# EAGLE design mroneV0-4 (EAGLE 5.09)
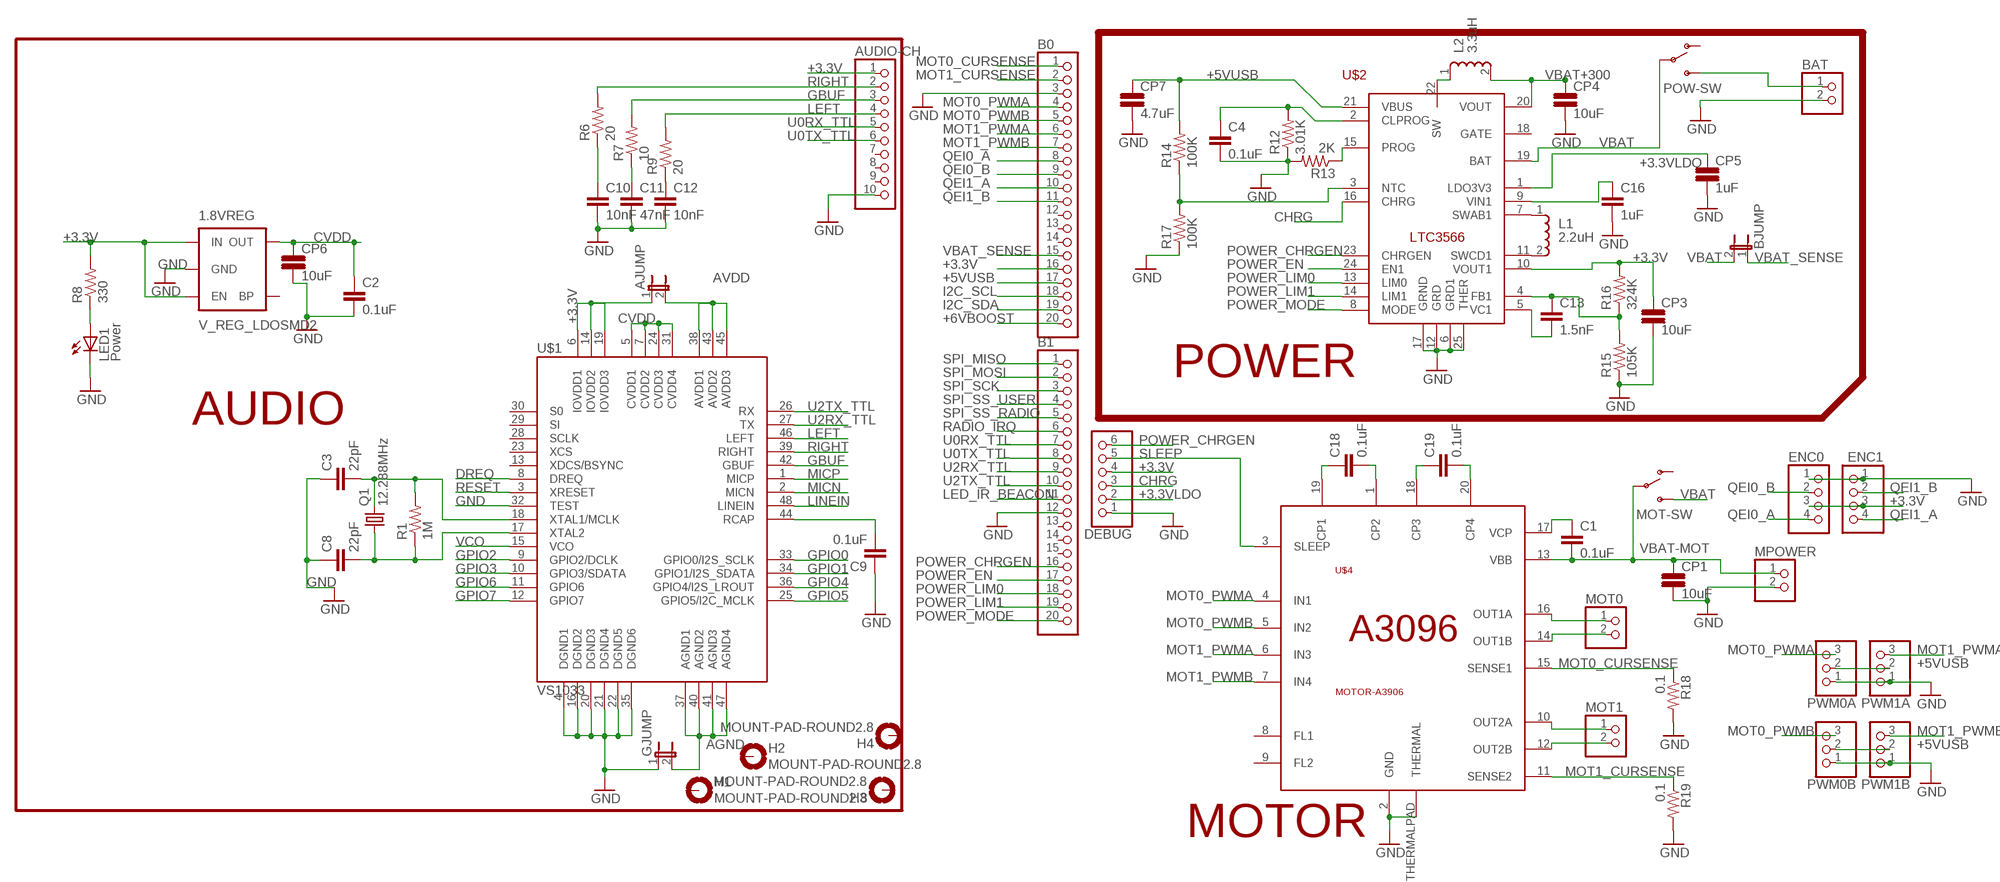
[diagram p0: schematic, sheet 1]

## Parts
1.8VREG  V_REG_LDOSMD2  [SC70]
AJUMP  JUMPER-2PTH  [1X02]
AUDIO-CH  PINHD-1X10  [1X10]
B0  PINHD-1X20  [1X20]
B1  PINHD-1X20  [1X20]
BAT  PINHD-1X2  [1X02]
BJUMP  JUMPER-2PTH  [1X02]
C1  0.1uF  CAP0402-CAP  [0402-CAP]
C2  0.1uF  CAP0402-CAP  [0402-CAP]
C3  22pF  CAP0402-CAP  [0402-CAP]
C4  0.1uF  CAP0402-CAP  [0402-CAP]
C8  22pF  CAP0402-CAP  [0402-CAP]
C9  0.1uF  CAP0402-CAP  [0402-CAP]
C10  10nF  CAP0402-CAP  [0402-CAP]
C11  47nF  CAP0402-CAP  [0402-CAP]
C12  10nF  CAP0402-CAP  [0402-CAP]
C13  1.5nF  CAP0402-CAP  [0402-CAP]
C16  1uF  CAP0402-CAP  [0402-CAP]
C18  0.1uF  CAP0402-CAP  [0402-CAP]
C19  0.1uF  CAP0402-CAP  [0402-CAP]
CP1  10uF  CAP-L  [0603-CAP]
CP3  10uF  CAP-L  [0603-CAP]
CP4  10uF  CAP-L  [0603-CAP]
CP5  1uF  CAP-L  [0603-CAP]
CP6  10uF  CAP-L  [0603-CAP]
CP7  4.7uF  CAP-L  [0603-CAP]
DEBUG  PINHD-1X6  [1X06]
ENC0  PINHD-1X4  [1X04]
ENC1  PINHD-1X4  [1X04]
GJUMP  JUMPER-2PTH  [1X02]
H1  MOUNT-PAD-ROUND2.8  [2,8-PAD]
H2  MOUNT-PAD-ROUND2.8  [2,8-PAD]
H3  MOUNT-PAD-ROUND2.8  [2,8-PAD]
H4  MOUNT-PAD-ROUND2.8  [2,8-PAD]
L1  2.2uH  INDUC-LPS4018LPS4018-REC  [LPS4018-REC]
L2  3.3uH  INDUC-LPS4018LPS4018-REC  [LPS4018-REC]
LED1  Power  LED0603  [LED-0603]
MOT0  PINHD-1X2  [1X02]
MOT1  PINHD-1X2/90  [1X02/90]
MOT-SW  SWITCH-SPSTPTH  [SWITCH-SPDT]
MPOWER  PINHD-1X2  [1X02]
POW-SW  SWITCH-SPSTPTH  [SWITCH-SPDT]
PWM0A  PINHD-1X3  [1X03]
PWM0B  PINHD-1X3  [1X03]
PWM1A  PINHD-1X3  [1X03]
PWM1B  PINHD-1X3  [1X03]
Q1  12.288MHz  CRYSTAL5X3  [CRYSTAL-SMD-5X3]
R1  1M  RESISTOR0603-RES  [0603-RES]
R6  20  RESISTOR0603-RES  [0603-RES]
R7  10  RESISTOR0603-RES  [0603-RES]
R8  330  RESISTOR0603-RES  [0603-RES]
R9  20  RESISTOR0603-RES  [0603-RES]
R12  3.01K  RESISTOR0603-RES  [0603-RES]
R13  2K  RESISTOR0603-RES  [0603-RES]
R14  100K  RESISTOR0603-RES  [0603-RES]
R15  105K  RESISTOR0603-RES  [0603-RES]
R16  324K  RESISTOR0603-RES  [0603-RES]
R17  100K  RESISTOR0603-RES  [0603-RES]
R18  0.1  RESISTOR0603-RES  [0603-RES]
R19  0.1  RESISTOR0603-RES  [0603-RES]
U$1  VS1033  [LQFP-48]
U$2  POWER-LTC3566  [QFN-24]
U$4  MOTOR-A3906  [QFN-20]

## Nets
+3.3V [power]: 1.8VREG.1(IN) 1.8VREG.3(EN) AJUMP.1 AUDIO-CH.1 B0.16 CP3.1 DEBUG.4 ENC0.3 ENC1.3 R8.2 R16.2 U$1.6(IOVDD1) U$1.14(IOVDD2) U$1.19(IOVDD3) U$2.10(VOUT1)
+3.3VLDO: CP5.1 DEBUG.2 U$2.1(LDO3V3)
+5VUSB [power]: B0.17 CP7.1 PWM0A.2 PWM0B.2 PWM1A.2 PWM1B.2 R14.2 U$2.21(VBUS)
+6VBOOST: B0.20
AGND: GJUMP.2 U$1.37(AGND1) U$1.40(AGND2) U$1.41(AGND3) U$1.47(AGND4)
AVDD: AJUMP.2 U$1.38(AVDD1) U$1.43(AVDD2) U$1.45(AVDD3)
CHRG: DEBUG.3 U$2.16(CHRG)
CVDD: 1.8VREG.5(OUT) C2.1 CP6.1 U$1.5(CVDD1) U$1.7(CVDD2) U$1.24(CVDD3) U$1.31(CVDD4)
DREQ: U$1.8(DREQ)
GBUF: AUDIO-CH.3 R7.2 U$1.42(GBUF)
GND: 1.8VREG.2(GND) AUDIO-CH.10 B0.3 B1.12 BAT.2 C2.2 C3.1 C4.2 C8.1 C9.1 C10.2 C11.2 C12.2 C16.2 CP1.2 CP3.2 CP4.2 CP5.2 CP6.2 CP7.2 DEBUG.1 ENC0.1 ENC1.1 GJUMP.1 LED1.C MPOWER.2 PWM0A.1 PWM0B.1 PWM1A.1 PWM1B.1 R12.1 R13.2 R15.1 R17.1 R18.2 R19.2 U$1.4(DGND1) U$1.16(DGND2) U$1.20(DGND3) U$1.21(DGND4) U$1.22(DGND5) U$1.32(TEST) U$1.35(DGND6) U$2.6(GRD1) U$2.12(GRD) U$2.17(GRND) U$2.25(THER) U$4.2(GND) U$4.THERMALPAD(THERMAL)
GPIO0: U$1.33(GPIO0/I2S_SCLK)
GPIO1: U$1.34(GPIO1/I2S_SDATA)
GPIO2: U$1.9(GPIO2/DCLK)
GPIO3: U$1.10(GPIO3/SDATA)
GPIO4: U$1.36(GPIO4/I2S_LROUT)
GPIO5: U$1.25(GPIO5/I2C_MCLK)
GPIO6: U$1.11(GPIO6)
GPIO7: U$1.12(GPIO7)
I2C_SCL: B0.18
I2C_SDA: B0.19
LED_IR_BEACON: B1.11
LEFT: AUDIO-CH.4 R9.2 U$1.46(LEFT)
LINEIN: U$1.48(LINEIN)
MICN: U$1.2(MICN)
MICP: U$1.1(MICP)
MOT0_CURSENSE [power]: B0.1 R18.1 U$4.15(SENSE1)
MOT0_PWMA: B0.4 PWM0A.3 U$4.4(IN1)
MOT0_PWMB: B0.5 PWM0B.3 U$4.5(IN2)
MOT1_CURSENSE [power]: B0.2 R19.1 U$4.11(SENSE2)
MOT1_PWMA: B0.6 PWM1A.3 U$4.6(IN3)
MOT1_PWMB: B0.7 PWM1B.3 U$4.7(IN4)
N$1: C9.2 U$1.44(RCAP)
N$2: C12.1 R9.1
N$3: C10.1 R6.1
N$4: C18.1 U$4.19(CP1)
N$5: C11.1 R7.1
N$6: LED1.A R8.1
N$7: R14.1 R17.2 U$2.3(NTC)
N$8: C4.1 R12.2 U$2.2(CLPROG)
N$9: C3.2 Q1.3 R1.2 U$1.18(XTAL1/MCLK)
N$10: C8.2 Q1.1 R1.1 U$1.17(XTAL2)
N$11: L2.1(A) U$2.22(SW)
N$12 [motors]: MOT0.1 U$4.16(OUT1A)
N$13: L1.1(A) U$2.7(SWAB1)
N$14: L1.2(E) U$2.11(SWCD1)
N$15: C13.2 U$2.5(VC1)
N$16: C13.1 R15.2 R16.1 U$2.4(FB1)
N$17: C16.1 U$2.9(VIN1)
N$18 [motors]: MOT0.2 U$4.14(OUT1B)
N$19 [motors]: MOT1.2 U$4.12(OUT2B)
N$20 [motors]: MOT1.1 U$4.10(OUT2A)
N$21 [motors]: BAT.1 POW-SW.3(S)
N$23: C18.2 U$4.1(CP2)
N$24: R13.1 U$2.15(PROG)
N$26: C19.1 U$4.18(CP3)
N$28: C19.2 U$4.20(CP4)
N$29: C1.1 U$4.17(VCP)
POWER_CHRGEN: B1.16 DEBUG.6 U$2.23(CHRGEN)
POWER_EN: B1.17 U$2.24(EN1)
POWER_LIM0: B1.18 U$2.13(LIM0)
POWER_LIM1: B1.19 U$2.14(LIM1)
POWER_MODE: B1.20 U$2.8(MODE)
QEI0_A: B0.8 ENC0.4
QEI0_B: B0.9 ENC0.2
QEI1_A: B0.10 ENC1.4
QEI1_B: B0.11 ENC1.2
RADIO_IRQ: B1.6
RESET: U$1.3(XRESET)
RIGHT: AUDIO-CH.2 R6.2 U$1.39(RIGHT)
SLEEP: DEBUG.5 U$4.3(SLEEP)
SPI_MISO: B1.1
SPI_MOSI: B1.2
SPI_SCK: B1.3
SPI_SS_RADIO: B1.5
SPI_SS_USER: B1.4
U0RX_TTL: AUDIO-CH.5 B1.7
U0TX_TTL: AUDIO-CH.6 B1.8
U2RX_TTL: B1.9 U$1.27(TX)
U2TX_TTL: B1.10 U$1.26(RX)
VBAT [power]: BJUMP.2 MOT-SW.3(S) POW-SW.2(P) U$2.19(BAT)
VBAT+300: CP4.1 L2.2(E) U$2.20(VOUT)
VBAT-MOT: C1.2 CP1.1 MOT-SW.2(P) MPOWER.1 U$4.13(VBB)
VBAT_SENSE [power]: B0.15 BJUMP.1
VCO: U$1.15(VCO)
Unconnected: 1.8VREG.4(BP) AUDIO-CH.7 AUDIO-CH.8 AUDIO-CH.9 B0.12 B0.13 B0.14 B1.13 B1.14 B1.15 H1.B2,8(MOUNT) H2.B2,8(MOUNT) H3.B2,8(MOUNT) H4.B2,8(MOUNT) MOT-SW.1(O) POW-SW.1(O) U$1.13(XDCS/BSYNC) U$1.23(XCS) U$1.28(SCLK) U$1.29(SI) U$1.30(S0) U$2.18(GATE) U$4.8(FL1) U$4.9(FL2)

## Notes on the sheet
- POWER
- AUDIO
- MOTOR

## Library data of the parts
1.8VREG = SparkFun:V_REG_LDO: Voltage Regulator LDO Standard 150mA LDO voltage regulator in SOT-23 layout. Micrel part MIC5205. BP (by-pass) pin is used to lower output noise with 470pF cap.
AJUMP BJUMP GJUMP = SparkFun:JUMPER-2: Jumper Basic 0.1" spaced jumper. Use with breakaway headers.
AUDIO-CH = pinhead:PINHD-1X10: PIN HEADER
B0 B1 = pinhead:PINHD-1X20: PIN HEADER
BAT MOT0 MOT1 MPOWER = pinhead:PINHD-1X2: PIN HEADER
C1-C4 C8-C13 C16 C18 C19 = SparkFun:CAP: Capacitor Standard 0603 ceramic capacitor, and 0.1" leaded capacitor.
CP1 CP3-CP7 = mrone:CAP-L
DEBUG = pinhead:PINHD-1X6: PIN HEADER
ENC0 ENC1 = pinhead:PINHD-1X4: PIN HEADER
H1-H4 = holes:MOUNT-PAD-ROUND: MOUNTING PAD, round
L1 L2 = mrone:INDUC-LPS4018
LED1 = SparkFun:LED: LEDs Standard schematic elements and footprints for 5mm, 3mm, 1206, and 0603 sized LEDs. 5mm - Spark Fun Electronics SKU : COM-00529 (and others)
MOT-SW POW-SW = SparkFun:SWITCH-SPST: SPST Switch Simple slide switch. Spark Fun Electronics SKU : COM-00102
PWM0A PWM0B PWM1A PWM1B = pinhead:PINHD-1X3: PIN HEADER
Q1 = SparkFun:CRYSTAL: Crystals Various standard crystals. Proven footprints. Spark Fun Electronics SKU : COM-00534
R1 R6-R9 R12-R19 = SparkFun:RESISTOR: Resistor Basic schematic elements and footprints for 0603, 1206, and PTH 1/10th watt (small) resistors.
U$1 = SparkFun:VS1033
U$2 = mrone:POWER-LTC3566
U$4 = mrone:MOTOR-A3906

## Net classes
0 default: width 0.203 mm, drill 0.203 mm, clearance 0.203 mm
1 motors: width 0.457 mm, drill 0.203 mm, clearance 0.203 mm
2 power: width 0.279 mm, drill 0.203 mm, clearance 0.203 mm

## Board
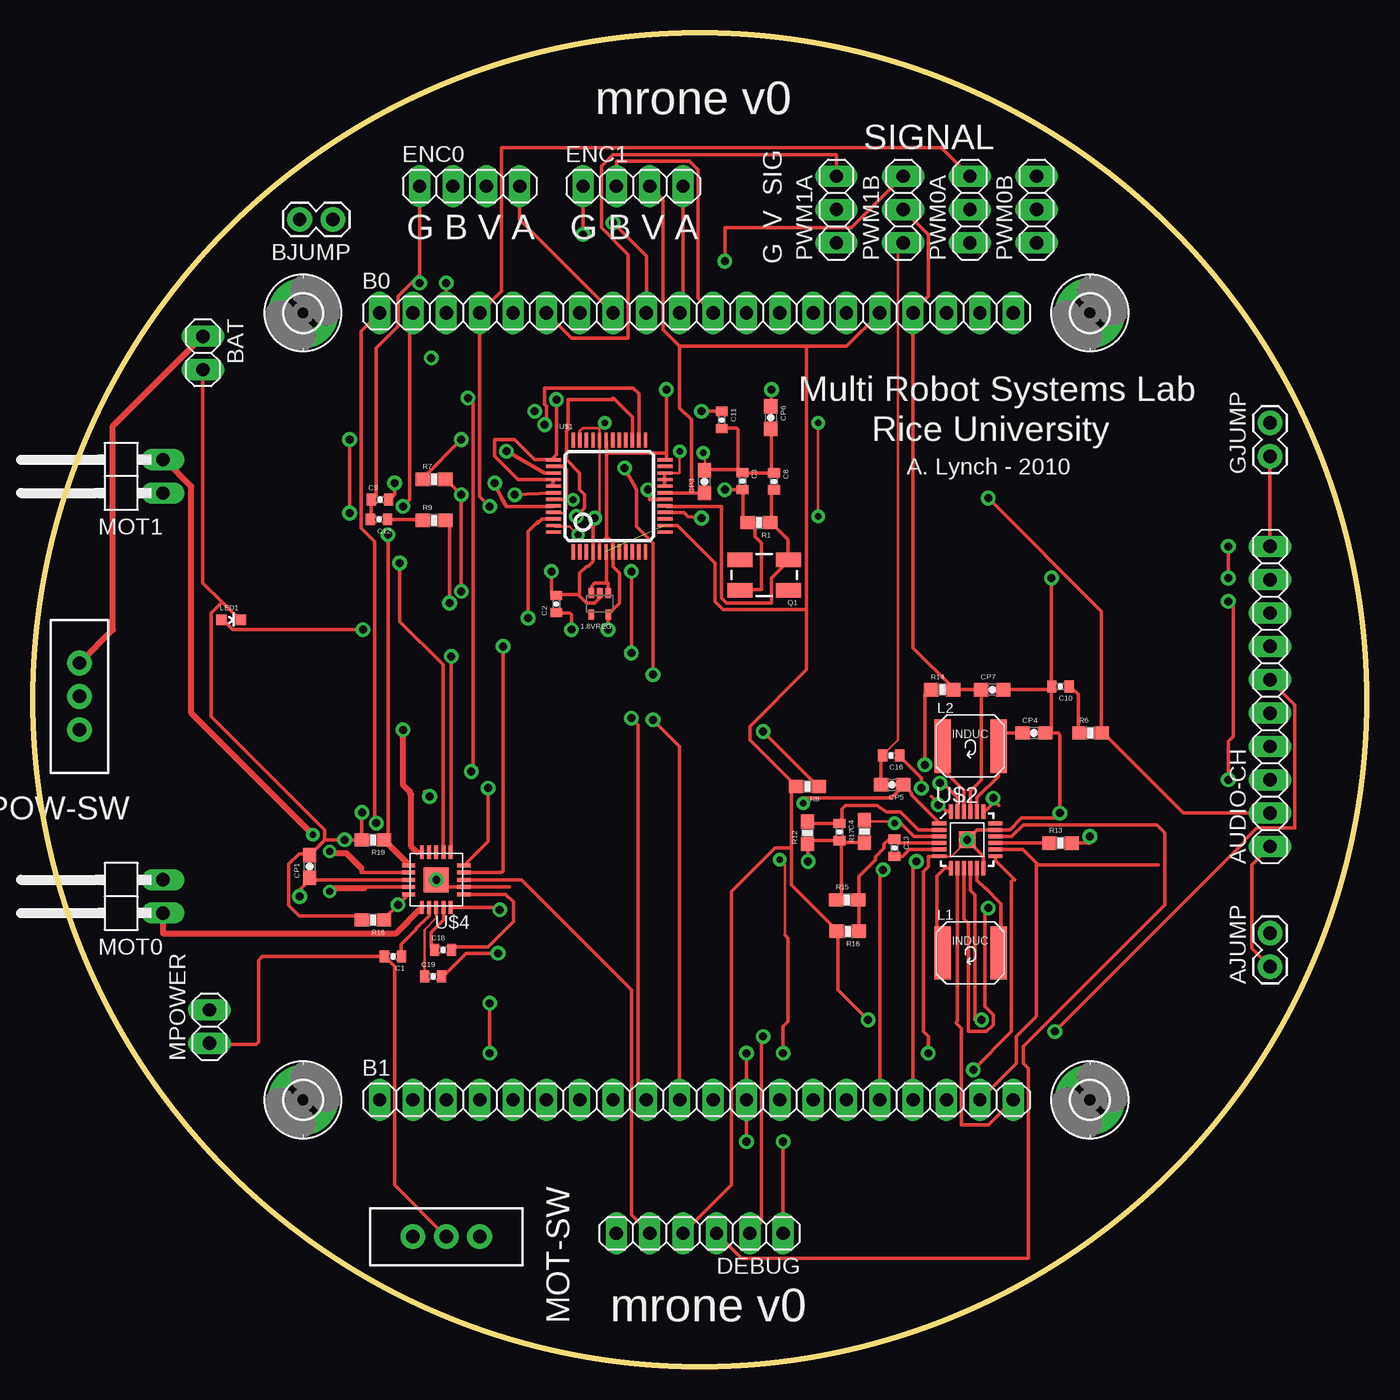
[diagram p1: board, top side]
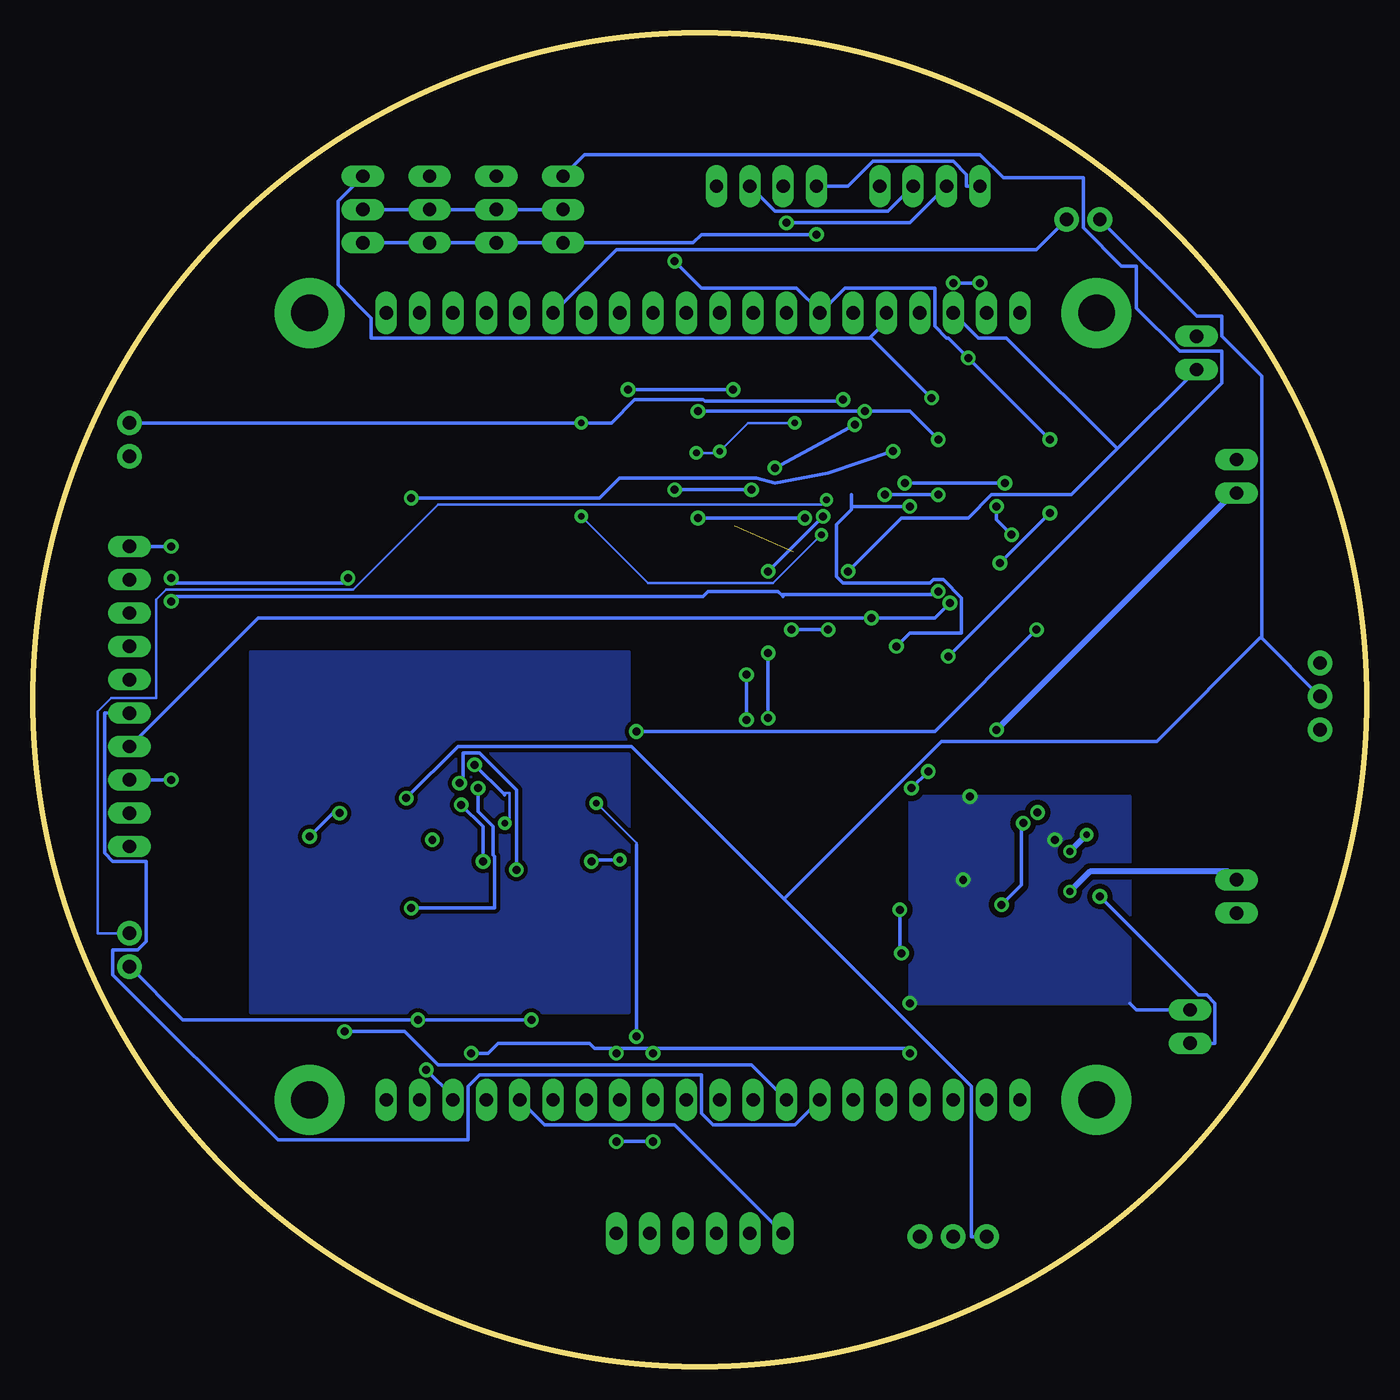
[diagram p2: board, bottom side, seen from below]

Size 101.6 x 101.6 mm. Coordinates in mm from the lower left corner, seen from the top.
Outline: circle at 50.8,50.8 radius 50.8
Copper layers (1*16): Top 0.035mm / dielectric 1.5mm / Bottom 0.035mm
Design rules "SparkFun": minimum track width 8mil, minimum drill 20mil, track to track 8mil, track to pad 8mil, pad to pad 8mil, via to via 8mil, smd to smd 8mil, copper to edge 10mil, drill to drill 8mil, minimum pad ring 12mil, minimum via ring 10mil, stop-mask expansion 4mil, vias tented up to drill 25mil, thermal gap 10mil

### Footprints (pad centres in the part's own frame; a part is rotated, then mirrored left to right if it is on the bottom)
SC70 = smd 0.4 x 0.75: 1 -0.65,-0.825; 2 0,-0.825; 3 0.65,-0.825; 4 0.65,0.825; 5 -0.65,0.825
1X02 = drill 1.016 pad 1.88 round: 1 0,0; 2 2.54,0
1X10 = drill 1.016 long: 1 -11.43,0; 2 -8.89,0; 3 -6.35,0; 4 -3.81,0; 5 -1.27,0; 6 1.27,0; 7 3.81,0; 8 6.35,0; 9 8.89,0; 10 11.43,0
1X20 = drill 1.016 long: 1 -24.13,0; 2 -21.59,0; 3 -19.05,0; 4 -16.51,0; 5 -13.97,0; 6 -11.43,0; 7 -8.89,0; 8 -6.35,0; 9 -3.81,0; 10 -1.27,0; 11 1.27,0; 12 3.81,0; 13 6.35,0; 14 8.89,0; 15 11.43,0; 16 13.97,0; 17 16.51,0; 18 19.05,0; 19 21.59,0; 20 24.13,0
1X02' = drill 1.016 long: 1 -1.27,0; 2 1.27,0
0402-CAP = smd 0.7 x 0.9: 1 -0.65,0; 2 0.65,0
0603-CAP = smd 1.1 x 1: 1 -0.85,0; 2 0.85,0
1X06 = drill 1.016 long: 1 -6.35,0; 2 -3.81,0; 3 -1.27,0; 4 1.27,0; 5 3.81,0; 6 6.35,0
1X04 = drill 1.016 long: 1 -3.81,0; 2 -1.27,0; 3 1.27,0; 4 3.81,0
2,8-PAD = drill 2.8 pad 5.334 round: B2,8 0,0
LPS4018-REC = smd 1.27 x 4.064: 1 -2.134,0.025; 2 2.134,0.025
LED-0603 = smd 0.8 x 0.8: A 0,-0.75; C 0,0.75
1X02/90 = drill 1.016 long: 1 -1.27,-3.81; 2 1.27,-3.81
SWITCH-SPDT = drill 1.016 pad 1.88 round: 1 0,2.54; 2 0,0; 3 0,-2.54
1X03 = drill 1.016 long: 1 -2.54,0; 2 0,0; 3 2.54,0
CRYSTAL-SMD-5X3 = smd 1.9 x 1.1: 1 -1.85,-1.15; 2 1.85,-1.15; 3 1.85,1.15; 4 -1.85,1.15
0603-RES = smd 1.1 x 1: 1 -0.85,0; 2 0.85,0
LQFP-48 = smd 0.254 x 1.143: 1 -2.75,-4.25; 2 -2.25,-4.25; 3 -1.75,-4.25; 4 -1.25,-4.25; 5 -0.75,-4.25; 6 -0.25,-4.25; 7 0.25,-4.25; 8 0.75,-4.25; 9 1.25,-4.25; 10 1.75,-4.25; 11 2.25,-4.25; 12 2.75,-4.25; 25 2.75,4.25; 26 2.25,4.25; 27 1.75,4.25; 28 1.25,4.25; 29 0.75,4.25; 30 0.25,4.25; 31 -0.25,4.25; 32 -0.75,4.25; 33 -1.25,4.25; 34 -1.75,4.25; 35 -2.25,4.25; 36 -2.75,4.25 | smd 1.143 x 0.254: 13 4.25,-2.75; 14 4.25,-2.25; 15 4.25,-1.75; 16 4.25,-1.25; 17 4.25,-0.75; 18 4.25,-0.25; 19 4.25,0.25; 20 4.25,0.75; 21 4.25,1.25; 22 4.25,1.75; 23 4.25,2.25; 24 4.25,2.75; 37 -4.25,2.75; 38 -4.25,2.25; 39 -4.25,1.75; 40 -4.25,1.25; 41 -4.25,0.75; 42 -4.25,0.25; 43 -4.25,-0.25; 44 -4.25,-0.75; 45 -4.25,-1.25; 46 -4.25,-1.75; 47 -4.25,-2.25; 48 -4.25,-2.75
QFN-24 = smd 1.1 x 0.3: 1 -2.15,1.25; 2 -2.15,0.75; 3 -2.15,0.25; 4 -2.15,-0.25; 5 -2.15,-0.75; 6 -2.15,-1.25; 13 2.15,-1.25; 14 2.15,-0.75; 15 2.15,-0.25; 16 2.15,0.25; 17 2.15,0.75; 18 2.15,1.25 | smd 0.3 x 1.1: 7 -1.25,-2.15; 8 -0.75,-2.15; 9 -0.25,-2.15; 10 0.25,-2.15; 11 0.75,-2.15; 12 1.25,-2.15; 19 1.25,2.15; 20 0.75,2.15; 21 0.25,2.15; 22 -0.25,2.15; 23 -0.75,2.15; 24 -1.25,2.15 | smd 1.27 x 1.27: 25 0,0
QFN-20 = smd 1 x 0.3: 1 -2.1,1.1; 2 -2.1,0.55; 3 -2.1,0; 4 -2.1,-0.55; 5 -2.1,-1.1; 11 2.1,-1.1; 12 2.1,-0.55; 13 2.1,0; 14 2.1,0.55; 15 2.1,1.1 | smd 0.3 x 1: 6 -1.1,-2.1; 7 -0.55,-2.1; 8 0,-2.1; 9 0.55,-2.1; 10 1.1,-2.1; 16 1.1,2.1; 17 0.55,2.1; 18 0,2.1; 19 -0.55,2.1; 20 -1.1,2.1 | smd 1.9 x 1.9: THERMALPAD 0,0

### Placement (x,y rotation side)
1.8VREG  43.18,58.12 180 top
AJUMP  94.23,30.48 90 top
AUDIO-CH  94.23,51.05 90 top
B0  50.55,80.26 0 top
B1  50.55,20.32 0 top
BAT  [1X02']  12.95,77.22 270 top
BJUMP  22.86,87.38 180 top
C1  27.43,31.24 180 top
C2  39.88,58.09 90 top
C3  54.05,67.46 270 top
C4  61.44,40.72 270 top
C8  56.46,67.44 270 top
C9  26.44,66.04 0 top
C10  78.28,51.82 180 top
C11  52.48,72.11 270 top
C12  26.37,64.54 180 top
C13  65.63,39.52 270 top
C16  65.38,46.56 180 top
C18  31.24,31.75 0 top
C19  30.48,29.72 0 top
CP1  21.08,38.1 90 top
CP3  51.16,67.41 90 top
CP4  76.25,48.26 0 top
CP5  65.46,44.32 180 top
CP6  56.21,72.29 270 top
CP7  73.08,51.56 0 top
DEBUG  50.8,10.16 180 top
ENC0  33.27,89.92 0 top
ENC1  45.72,89.92 0 top
GJUMP  94.23,69.34 90 top
H1  80.52,20.32 0 top
H2  20.57,20.32 0 top
H3  80.52,80.26 0 top
H4  20.57,80.26 0 top
L1  71.42,31.5 0 top
L2  71.42,47.24 0 top
LED1  15.11,56.9 270 top
MOT0  [1X02/90]  6.1,35.81 90 top
MOT1  6.1,67.82 90 top
MOT-SW  31.5,9.91 270 top
MPOWER  [1X02']  13.46,25.91 90 top
POW-SW  3.56,51.05 180 top
PWM0A  71.37,88.14 90 top
PWM0B  76.45,88.14 90 top
PWM1A  61.21,88.14 90 top
PWM1B  66.29,88.14 90 top
Q1  55.7,60.3 180 top
R1  55.32,64.29 180 top
R6  80.57,48.26 0 top
R7  30.56,67.59 0 top
R8  59,44.2 180 top
R9  30.56,64.47 0 top
R12  59,40.67 90 top
R13  78.28,39.88 0 top
R14  69.27,51.56 0 top
R15  62.03,35.56 0 top
R16  62.08,33.17 180 top
R17  63.35,40.77 90 top
R18  25.91,34.04 180 top
R19  25.91,40.13 180 top
U$1  43.92,66.32 0 top
U$2  71.17,40.13 0 top
U$4  30.73,37.08 180 top

### Tracks (layer width: path | path; a pad name or v marks a point on that pad's centre or on a via)
+3.3V  (via drill 0.61)  (1 unrouted)
  Top 0.254: 71.42,36.27 U$2.10 | 71.88,26.42 71.88,26.29 | U$1.14 49.09,64.07 49.4,63.75
  Top 0.279: AUDIO-CH.1 92.84,38.23 92.84,31.88 AJUMP.1 | 71.88,26.42 v72.26,26.42 71.75,26.42 71.75,35.94 71.42,36.27 | 43.69,59.69 43.81,59.69 43.81,59.05 1.8VREG.1 | 43.69,59.69 42.8,59.69 42.54,59.44 42.54,59.05 1.8VREG.3 | U$1.6 43.69,61.98 43.69,59.69 | 57.78,39.5 57.78,36.7 61.21,33.27 R16.2 61.34,33.15 61.34,28.7 v63.63,26.42 | 57.78,39.5 57.78,43.94 58.04,44.2 R8.2 58.04,44.32 54.61,47.75 54.61,48.77 58.93,53.09 58.93,57.66 | DEBUG.4 53.21,13.84 53.21,36.2 56.52,39.5 57.78,39.5 | 50.16,66.55 48.26,66.55 U$1.19 | 50.16,66.55 51.05,66.55 CP3.1 | 49.28,77.72 49.28,73.03 50.16,72.14 50.16,66.55 | 49.28,77.72 48.01,78.99 48.01,88.9 ENC1.3 | B0.16 61.98,77.72 58.93,77.72 | 58.93,77.72 49.28,77.72 | 58.93,57.66 58.93,77.72 | 49.4,63.75 51.94,61.21 51.94,58.29 52.58,57.66 58.93,57.66
  Bottom 0.279: ENC0.3 36.45,88.01 45.09,88.01 ENC1.3 | AJUMP.1 90.17,26.42 v72.26,26.42 v63.63,26.42
+3.3VLDO  (via drill 0.51, 0.61)
  Top 0.203: v58.67,42.93 58.67,43.31
  Top 0.254: U$2.1 69.02,41.47 66.93,43.56 66.93,43.7 CP5.1 66.29,44.2 65.41,43.31 58.67,43.31 | v55.63,25.15 55.5,25.02 55.5,11.05 DEBUG.2
  Bottom 0.203: v58.67,42.93 55.63,39.88 55.63,39.75
  Bottom 0.254: v55.63,25.15 55.63,39.75
+5VUSB
  Top 0.254: U$2.21 71.42,43.86
  Top 0.279: PWM1B.2 68.2,86.23 68.2,81.53 67.06,80.39 B0.17 67.06,54.74 70.1,51.69 R14.2 CP7.1 72.26,51.44 72.26,44.7 71.42,43.86
  Bottom 0.279: PWM1A.2 PWM1B.2 PWM0A.2 PWM0B.2
AGND  (via drill 0.51, 0.61)
  Top 0.203: v41.53,63.37 40.89,64.01 39.75,64.01 U$1.47 | v59.82,64.77 v59.82,71.88
  Top 0.254: 39.5,67.18 U$1.41 39.62,67.18 39.62,67.56 U$1.40 39.5,67.56 36.96,67.56 35.18,69.34 35.18,70.61 36.7,70.61 38.23,69.09 39.62,69.09 | 39.62,69.09 U$1.37 | v39.88,73.66 39.88,69.47 39.62,69.22 39.62,69.09
  Bottom 0.203: v41.53,63.37 45.21,59.69 54.74,59.69 v59.82,64.77
  Bottom 0.254: v39.88,73.66 40,73.53 50.42,73.53 50.55,73.66 55.75,73.66 57.53,71.88 v59.82,71.88 GJUMP.2
AVDD  (via drill 0.51)
  Top 0.203: U$1.45 39.75,65.02 40.51,65.02 40.51,65.28 40.64,65.41 40.64,66.04 v41.15,66.04
  Top 0.254: U$1.43 39.75,66.04 40.64,66.04 40.64,68.33 40.39,68.58 39.75,68.58 U$1.38
  Bottom 0.203: v41.15,66.04 41.53,65.66 70.74,65.66 77.22,59.18 91.44,59.18 92.2,58.42 92.2,50.93 95.63,50.93 96.65,49.91 96.65,33.02 AJUMP.2
CHRG
  Top 0.254: U$2.16 74.54,40.38 75.44,41.27 85.6,41.27 86.23,40.64 86.23,35.18 75.44,24.38 75.44,23.11 75.82,22.73 75.82,8.25 53.97,8.25 DEBUG.3
CVDD  (via drill 0.61)
  Top 0.203: 43.69,63.25 43.18,62.74 43.18,62.1 U$1.5
  Top 0.254: v56.26,74.42 56.26,73.15 CP6.1 | 48.26,69.6 48.26,69.09 U$1.24 | 48.26,69.6 v48.26,74.42 | v43.81,56.13 43.81,57.28 1.8VREG.5 43.94,57.4 44.7,58.17 44.7,60.45 44.2,60.96 44.2,61.98 U$1.7 44.2,62.1 44.2,62.74 43.69,63.25 43.69,69.47 43.88,69.66 | v41.02,56.13 41.02,57.28 40.89,57.4 39.88,57.4 C2.1 | 43.88,69.66 43.94,69.6 48.26,69.6 | 43.88,69.66 43.69,69.85 43.69,70.48 U$1.31
  Bottom 0.254: v48.26,74.42 v56.26,74.42 | v41.02,56.13 v43.81,56.13
GBUF  (via drill 0.61)
  Top 0.254: v91.06,58.29 91.44,57.91 91.44,48.01 91.06,47.62 v91.06,44.7 | 39.62,66.55 U$1.42 39.5,66.55 v36.7,66.42 | v32.64,59.05 v32.64,66.42 31.5,67.56 R7.2
  Bottom 0.254: 44.51,58.74 44.83,59.05 50.16,59.05 50.55,58.67 90.68,58.67 v91.06,58.29 | 44.51,58.74 44.45,58.67 | v91.06,44.7 AUDIO-CH.3 | v32.64,59.05 32.89,58.8 44.45,58.8 44.51,58.74 | v32.64,66.42 v36.7,66.42
GND  (via drill 0.51, 0.6, 0.61)
  Top 0.203: v49.28,69.72 49.28,68.07 48.26,68.07 U$1.22 | v51.05,69.6 51.18,69.47 51.18,68.45 CP3.2 | 43.18,71.5 41.91,71.5 41.66,71.25 41.66,70.61 U$1.35 | 43.18,71.5 43.18,70.61 U$1.32 43.18,70.48 43.18,65.02 v42.8,64.64 | PWM1B.1 65.91,85.22 65.91,47.75 64.77,46.61 C16.2 | 43.18,71.5 v43.56,71.88 | U$2.25 71.12,40 69.98,38.86 69.09,38.86 U$2.6 | v56.9,38.61 57.28,38.23 57.28,32.89
  Top 0.254: U$4.THERMALPAD 31.28,36.53 U$4.2 36.28,36.53 36.3,36.55 | v23.75,40.13 22.26,40.13 CP1.2 | v23.75,40.13 22.25,40.13 22.24,40.12 | v23.75,40.13 R19.2 25.06,42.15 25.07,42.16 | 22.24,40.12 21.18,39.06 20.27,39.06 19.48,38.28 19.48,35.13 20.27,34.34 24.75,34.34 R18.2 | 61.59,39.92 R17.1 | 61.59,39.92 C4.2 59.25,40.07 R12.1 59.05,39.75 v59.05,38.48 | 61.59,39.92 61.59,35.97 R15.1 | U$2.12 72.42,38.88 U$2.25 71.92,40.88 U$2.17 74.41,40.88 75.31,41.78 78.23,41.78 v78.23,42.16 78.23,48.13 78.1,48.26 77.6,48.26 | CP5.2 64.61,46.43 C16.2 | AUDIO-CH.10 GJUMP.1 | 77.6,48.26 77.6,51.56 | 77.6,51.56 77.6,51.82 C10.2 | 77.6,48.26 CP4.2 77.22,48.26 | v80.52,40.39 80.52,39.88 R13.2 | 77.6,51.56 CP7.2 | 77.6,51.56 C10.2 | v91.06,60.07 v91.06,62.48 | v77.6,60.07 77.6,51.94 C10.2 | v68.2,23.88 68.2,25.15 67.82,25.53 67.82,37.72 68.2,38.1 68.2,38.86 68.96,38.86 U$2.6 | v54.36,23.88 B1.12 v54.36,17.14 | v57.15,17.14 DEBUG.1 | 57.28,32.89 57.53,32.64 57.53,26.29 57.15,25.91 v57.15,23.88 | 56.26,68.07 56.39,68.07 C8.1 56.26,68.07 | 56.26,68.07 54.1,68.07 C3.1 | 56.26,68.07 56.26,71.37 CP6.2 | U$1.20 48.13,67.18 48.13,67.56 U$1.21 48.13,67.69 48.13,67.94 U$1.22 | 53.72,68.33 53.72,68.07 53.97,68.07 C3.1 | 53.72,68.33 53.72,71.37 53.59,71.5 52.58,71.5 C11.2 | 41.59,58.74 41.53,58.8 39.88,58.8 | 41.59,58.74 42.16,58.17 42.8,58.17 43.18,58.55 1.8VREG.2 | 41.59,58.74 41.66,58.8 41.66,60.45 42.16,60.96 42.29,60.96 42.67,61.34 42.67,61.98 U$1.4 42.67,62.1 42.67,64.52 v42.8,64.64 | 39.88,58.8 39.5,58.8 v39.5,60.58 | 39.88,58.8 C2.2 | v29.46,82.55 29.46,83.19 | 29.46,83.19 ENC0.1 | B0.3 v31.5,82.55 | ENC1.1 v41.91,86.23
  Top 0.254: v30.23,43.43 29.84,43.81 | v34.8,23.88 v34.8,27.69 | 14.41,58.23 12.95,59.69 BAT.2 | 14.41,58.23 15.75,56.9 LED1.C | 53.72,68.33 51.18,68.33 CP3.2 | 53.72,68.33 C3.1 | C12.2 25.78,64.64 25.78,66.04 C9.1 25.91,66.04 26.16,66.29 26.16,77.6 27.81,79.25 27.81,81.53 29.46,83.19 | 14.41,58.23 13.59,57.4 13.59,49.53 22.22,40.89 22.22,40.13 22.24,40.12 | U$1.16 49.61,65.07 49.91,64.77 v50.93,64.64
  Bottom 0.203: v51.05,69.6 49.4,69.6 v49.28,69.72 47.12,71.88 v43.56,71.88
  Bottom 0.254: v80.52,40.39 78.74,42.16 v78.23,42.16 | v91.06,62.48 AUDIO-CH.10 | v91.06,60.07 90.68,59.69 77.98,59.69 v77.6,60.07 | v68.2,23.88 66.93,23.88 66.17,24.64 59.18,24.64 58.8,24.26 57.15,24.26 | 57.15,24.26 54.74,24.26 v54.36,23.88 54.61,24.26 35.18,24.26 v34.8,23.88 | v54.36,17.14 v57.15,17.14 | v59.05,38.48 58.93,38.61 v56.9,38.61 | 57.15,24.26 v57.15,23.88 | MPOWER.2 17.53,27.18 18.03,27.69 | PWM0B.1 PWM0A.1 PWM1B.1 PWM1A.1 51.31,85.6 50.67,86.23 v41.91,86.23 | ENC1.1 39.5,89.92 37.59,91.82 31.5,91.82 30.48,90.81 30.48,89.92 ENC0.1 | v31.5,82.55 v29.46,82.55 | v39.5,60.58 35.43,64.64 30.35,64.64 28.57,66.42 22.48,66.42 18.99,69.91 | BAT.2 18.99,69.91 | B0.3 29.59,78.36 27.43,78.36 18.99,69.91 | v42.8,64.64 v50.93,64.64
  other vias: 30.73,37.08 71.17,40.13
  pour Bottom (isolate 0.406): 18.03,43.43 34.8,43.43 34.8,27.69 18.03,27.69
LEFT  (via drill 0.61)
  Top 0.254: v31.75,58.17 31.75,64.13 31.5,64.39 R9.2 | U$1.46 38.79,64.57 38.54,64.32 | 38.54,64.32 38.48,64.26 | v37.72,57.02 37.72,63.63 38.48,64.39 38.54,64.32
  Bottom 0.254: v31.75,58.17 32.89,57.02 v37.72,57.02 84.45,57.02 AUDIO-CH.4
MOT0_CURSENSE  (via drill 0.61)
  Top 0.279: U$4.15 28.57,35.94 v27.81,35.18 26.8,34.16 26.8,34.04 R18.1 | v26.16,41.4 26.03,41.53 26.03,62.87 25.02,63.88 25.02,78.87 B0.1
  Bottom 0.279: v27.81,35.18 26.29,36.7 26.29,41.27 v26.16,41.4
MOT0_PWMA  (via drill 0.61)
  Top 0.254: U$4.4 35.68,37.63 35.71,37.67 35.81,37.72 v35.81,54.86 | PWM0A.3 69.22,92.84 35.69,92.84 35.69,81.91 B0.4 34.04,66.29 v34.8,65.53
  Bottom 0.254: v35.81,54.86 34.8,55.88 30.86,55.88 30.86,58.55 32.26,59.94 33.02,59.94 33.27,59.69 39.88,59.69 40.39,60.2 40.39,64.13 39.24,65.28 39.24,65.53 | 39.24,65.53 39.24,66.42 | 39.24,65.53 v34.8,65.53
MOT0_PWMB  (via drill 0.61)
  Top 0.254: v34.67,44.07 34.67,40 32.89,38.23 U$4.5 | v33.4,45.34 33.53,45.47 33.53,73.41 v33.15,73.79
  Bottom 0.254: PWM0B.3 78.36,88.77 78.36,82.42 75.82,79.88 75.82,78.36 37.85,78.36 37.78,78.42 | 37.78,78.42 36.58,79.63 B0.5 | v34.67,44.07 v33.4,45.34 | v33.15,73.79 37.78,78.42
MOT1_CURSENSE  (via drill 0.61)
  Top 0.279: v27.05,63.37 27.05,40.51 26.8,40.26 R19.1 | v28.19,65.53 28.7,66.04 28.7,80.01 B0.2
  Top 0.406: U$4.11 28.63,38.26 R19.1
  Bottom 0.279: v27.05,63.37 28.19,64.52 v28.19,65.53
MOT1_PWMA  (via drill 0.61)
  Top 0.254: v31.88,54.1 31.88,39.24 U$4.6 | B0.6 41.02,78.36 45.34,78.36 45.34,84.71 43.31,86.74 43.31,91.44 44.2,92.33 61.21,92.33 PWM1A.3
  Bottom 0.254: v31.88,54.1 11.05,74.93 11.05,77.34 14.22,77.34 17.53,80.65 17.53,83.82 18.67,83.82 21.59,86.74 21.59,90.55 27.69,90.55 29.46,92.33 59.56,92.33 PWM1A.3
MOT1_PWMB  (via drill 0.61)
  Top 0.254: PWM1B.3 62.36,86.74 52.7,86.74 v52.7,84.2 | v27.94,61.21 27.94,56.77 31.24,53.47 31.24,39.24 U$4.7 | v24.13,65.02 v24.13,70.61
  Bottom 0.254: v52.7,84.2 50.67,82.17 43.43,82.17 41.66,80.39 B0.7 39.75,82.17 32.89,82.17 32.89,79.25 32,78.36 31.88,78.36 v30.35,76.84 v24.13,70.61 | v27.94,61.21 v24.13,65.02
N$1  (via drill 0.61)
  Top 0.254: v27.56,67.31 27.56,66.42 27.18,66.04 C9.2 | v35.18,67.31 35.69,66.17 36.07,65.53 39.62,65.53 U$1.44
  Bottom 0.254: v27.56,67.31 v35.18,67.31
N$2
  Top 0.254: C12.1 27.05,64.52 29.59,64.52 R9.1
N$3
  Top 0.254: C10.1 78.99,51.82 79.63,51.18 79.63,48.26 R6.1
N$4
  Top 0.254: U$4.19 31.28,34.03 30.35,33.1 30.35,31.99 C18.1
N$5  (via drill 0.61)
  Top 0.254: v50.93,72.77 52.45,72.77 C11.1 | v32.64,70.61 29.72,67.69 R7.1
  Bottom 0.254: v50.93,72.77 v38.23,72.77 34.8,72.77 v32.64,70.61
N$6  (via drill 0.61)
  Top 0.254: v25.15,56.13 15.24,56.13 14.48,56.9 LED1.A | v55.63,48.39 59.82,44.2 R8.1
  Bottom 0.254: v25.15,56.13 32.89,48.39 v55.63,48.39
N$7  (via drill 0.51, 0.61)
  Top 0.203: 65.66,41.53 63.5,41.53 R17.2
  Top 0.254: U$2.3 67.11,40.38 65.94,41.55 65.66,41.55 65.66,41.53 v65.66,41.4 | R17.2 63.41,41.55 | v67.94,45.85 67.94,51.18 68.33,51.56 R14.1
  Bottom 0.203: v65.66,41.4 65.28,41.78 65.28,43.69 65.66,43.69 65.72,43.62
  Bottom 0.254: 65.66,43.56 65.72,43.62 v67.94,45.85
N$8
  Top 0.254: U$2.2 67.45,40.88 66.09,42.24 65.02,42.24 64.31,42.75 61.9,42.75 61.62,42.47 61.62,41.54 C4.1 59.15,41.37 R12.2
N$9  (via drill 0.61)
  Top 0.254: v46.86,66.8 46.99,66.67 46.99,66.04 48.13,66.04 U$1.18 | v52.7,66.8 53.97,66.8 C3.2 54.1,66.8 54.1,64.26 54.36,64.26 R1.2 54.48,64.26 54.99,64.26 54.99,63.25 55.5,62.74 55.5,59.18 53.97,59.18 Q1.3
  Bottom 0.254: v52.7,66.8 v46.86,66.8
N$10
  Top 0.254: C8.2 56.39,66.67 56.26,66.55 56.26,64.39 R1.1 56.26,64.26 57.53,62.99 57.53,61.47 Q1.1 57.53,61.34 56.26,60.07 56.26,58.17 52.83,58.17 52.45,58.55 52.45,65.53 48.26,65.53 U$1.17
N$11
  Top 0.254: U$2.22 70.92,43.89 69.22,45.59 69.22,47.19 L2.1
N$12
  Top 0.457: MOT0.1 9.91,33.02 27.69,33.02 29.59,34.92 U$4.16
N$13
  Top 0.254: U$2.7 69.48,37.98 68.86,37.36 68.86,31.95 L1.1
N$14
  Top 0.254: U$2.11 71.92,37.05 72.52,36.45 72.54,36.45 73.74,35.25 73.74,31.7 L1.2
N$15
  Top 0.254: U$2.5 66.76,39.38 66.24,38.86 65.64,38.86 C13.2
N$16
  Top 0.254: U$2.4 65.92,39.88 C13.1 65.22,40.17 64.85,39.8 64.85,39.5 64.19,38.84 64.19,38.58 62.94,37.34 62.94,35.62 R15.2 62.93,35.51 R16.1
N$17  (via drill 0.61)
  Top 0.254: U$2.9 70.92,34.11 71.25,33.78 71.25,25.53 72.64,25.53 73.15,26.04 73.15,26.8 72.52,27.43 72.52,34.67 v72.77,34.92 | v67.69,44.07 67.69,44.83 66.04,46.48 C16.1
  Bottom 0.254: v67.69,44.07 67.69,42.29 66.55,41.15 66.55,38.99 66.42,38.86 66.42,34.92 v72.77,34.92
N$18  (via drill 0.51)
  Top 0.254: U$4.14 25.27,36.53 25.27,36.45
  Top 0.457: 25.27,36.45 22.61,36.45 v22.61,36.2
  Bottom 0.457: v22.61,36.2 21.08,37.72 10.54,37.72 MOT0.2
N$19  (via drill 0.51)
  Top 0.254: U$4.12 25.02,37.63 25.02,37.97
  Top 0.457: 25.02,37.97 23.88,39.12 22.61,39.12 v22.61,39.24 | v21.34,40.51 12.06,49.78 12.06,67.06 10.03,69.09 MOT1.2
  Bottom 0.457: v22.61,39.24 v21.34,40.51
N$20  (via drill 0.61)
  Top 0.254: U$4.10 29.29,39.18
  Top 0.457: v28.19,48.51 28.19,44.32 28.7,43.81 28.7,43.71 28.83,43.56 28.83,39.62 29.21,39.24 29.29,39.18
  Bottom 0.457: v28.19,48.51 10.16,66.55 MOT1.1
N$21
  Top 0.457: BAT.1 6.1,71.63 6.1,56.13 POW-SW.3
N$22  (via drill 0.6)
  other vias: 25.07,42.21
N$23
  Top 0.254: U$4.1 36.02,35.98 36.6,35.41 36.6,33.91 34.67,31.98 32.12,31.98 C18.2
N$24
  Top 0.254: U$2.15 R13.1
N$25
  pour Bottom (isolate 0.305): 56.18,27 85.01,27 85.01,54.43 56.18,54.43
N$26
  Top 0.203: C19.1 29.84,29.72 29.84,33.27 30.73,34.16 U$4.18
N$28  (via drill 0.61)
  Top 0.254: U$4.20 35.3,34.98 35.36,34.92 35.43,34.92 v35.56,34.8 | v35.43,31.5 33.02,31.5 31.24,29.72 C19.2
  Bottom 0.254: v35.43,31.5 35.56,31.62 v35.56,34.8
N$29
  Top 0.254: U$4.17 30.18,34.35 29.21,33.38 29.21,33.33 28.04,32.16 28.04,31.28 C1.1
POWER_CHRGEN  (via drill 0.61)
  Top 0.254: U$2.23 70.42,43.37 69.47,44.32 69.09,44.32 v69.09,44.45 | v64.77,37.85 64.52,37.59 B1.16
  Bottom 0.254: v69.09,44.45 68.83,44.7 68.83,46.74 67.56,46.74 64.77,43.94 v64.77,37.85 | DEBUG.6 52.7,18.41 62.61,18.41 B1.16
POWER_EN  (via drill 0.61)
  Top 0.254: U$2.24 69.6,42.28 69.02,42.86 | 69.02,42.86 68.45,43.43 | v67.31,38.48 67.06,38.23 B1.17 | v68.96,42.8 69.02,42.86
  Bottom 0.254: v68.96,42.8 67.31,41.15 v67.31,38.48
POWER_LIM0  (via drill 0.61)
  Top 0.254: U$2.13 73.32,38.57 74.74,37.15 | 74.74,37.15 74.8,37.08 | v71.63,22.61 74.55,25.53 74.55,36.96 74.74,37.15
  Bottom 0.254: v71.63,22.61 69.6,20.57 B1.18
POWER_LIM1
  Top 0.254: U$2.14 75.43,39.38 76.52,38.29 | 76.52,38.29 76.58,38.23 85.72,38.23 | B1.19 74.93,23.11 74.93,25.15 76.45,26.67 76.45,38.23 76.52,38.29
POWER_MODE
  Top 0.254: U$2.8 70.42,26.33 70.36,26.26 70.36,26.16 70.74,25.78 70.74,18.41 72.77,18.41 B1.20
QEI0_A
  Top 0.254: B0.8 37.08,87.38 ENC0.4
QEI0_B  (via drill 0.61)
  Top 0.254: v44.2,87.12 46.74,84.58 B0.9
  Bottom 0.254: ENC0.2 34.8,87.12 v44.2,87.12
QEI1_A
  Top 0.254: B0.10 49.53,80.52 ENC1.4
QEI1_B
  Top 0.254: B0.11 50.67,81.41 50.67,91.19 50.04,91.82 44.45,91.82 ENC1.2
RIGHT  (via drill 0.61)
  Top 0.254: AUDIO-CH.2 87.63,42.16 81.53,48.26 R6.2 81.41,57.53 v72.77,66.17 | 39.62,68.07 U$1.39 38.99,68.07 v36.07,69.72
  Bottom 0.254: v72.77,66.17 58.42,66.17 56.9,67.69 46.48,67.69 45.09,67.31 41.02,68.07 v36.07,69.72
SLEEP
  Top 0.254: U$4.3 37.21,37.08 45.59,28.7 45.59,11.56 DEBUG.5
U0RX_TTL
  Bottom 0.254: B1.7 43.56,18.41 49.78,18.41 50.67,19.3 50.67,22.23 67.56,22.23 68.45,21.34 68.45,17.27 82.93,17.27 95.5,29.84 95.5,31.75 93.6,31.75 92.96,32.38 92.96,38.48 95.5,38.48 96.14,39.12 96.14,49.78 AUDIO-CH.5
U0TX_TTL  (via drill 0.61)
  Top 0.254: v77.85,25.53 92.33,40 92.33,40.13 93.22,41.02 96.14,41.02 96.14,50.42 AUDIO-CH.6
  Bottom 0.254: B1.8 46.86,22.99 70.74,22.99 73.28,25.53 v77.85,25.53
U2RX_TTL  (via drill 0.61)
  Top 0.254: U$1.27 45.67,72.32 44.26,73.72 | 44.26,73.72 44.2,73.79 | v41.4,64.77 42.04,65.41 42.04,66.42 41.66,66.8 41.66,68.07 40.64,69.09 40.64,71.25 40.77,71.37 40.77,73.66 44.2,73.66 44.26,73.72 | v45.59,54.36 v45.59,60.58 | v45.59,49.4 46.1,48.89 46.1,20.95 B1.9
  Bottom 0.254: v45.59,60.58 v41.4,64.77 | v45.59,49.4 v45.59,54.36
U2TX_TTL  (via drill 0.61)
  Top 0.254: U$1.26 46.17,74.1 45.72,74.55 38.99,74.55 38.99,73.28 39.12,73.15 39.12,71.88 v38.99,71.75 | v45.09,68.45 45.97,66.8 45.97,64.01 47.24,62.74 v47.24,52.7 | v47.24,49.28 49.28,47.24 B1.10
  Bottom 0.254: v45.09,68.45 v38.99,71.75 | v47.24,49.28 v47.24,52.7
VBAT  (via drill 0.61)
  Top 0.279: 73.6,42.74 73.15,43.18 v73.15,43.31 73.15,42.93 72.52,42.29 U$2.19
  Bottom 0.279: 8,55.5 POW-SW.2 | 8,55.5 8,75.44 11.05,78.49 11.05,80.01 12.95,80.01 BJUMP.2 | v73.15,43.31 69.22,47.24 56.01,47.24 44.39,35.62 | 44.39,35.62 30.1,21.34 30.1,9.91 MOT-SW.3 | 8,55.5 8.13,55.5 16,47.62 32.38,47.62 44.39,35.62
VBAT+300
  Top 0.254: U$2.20 71.92,43.35 73.53,44.96 73.53,47.24 L2.2 73.66,47.37 73.66,48.26 CP4.1
VBAT-MOT  (via drill 0.61)
  Top 0.254: 21.08,37.08 U$4.13 | MPOWER.1 13.54,24.56 17.02,24.56 17.2,24.74 17.2,30.96 17.47,31.24 C1.2 26.8,31.24 27.56,30.48 27.56,13.84 MOT-SW.2 | 21.08,37.08 20.32,36.32 v20.32,35.81 | 21.08,37.08 CP1.1
  Bottom 0.254: v20.32,35.81 12.83,28.32 12.19,28.32 11.56,27.69 11.56,24.64 MPOWER.1
VBAT_SENSE
  Bottom 0.279: B0.15 57.15,85.09 25.15,85.09 BJUMP.1

### Text on the board
tNames: mrone v0 | G V SIG | SIGNAL | G B V A | G B V A | Multi Robot Systems Lab | Rice University | A. Lynch - 2010 | mrone v0